# Altium schematic sheet Distance Switch IR and Hall.SchDoc
size A4
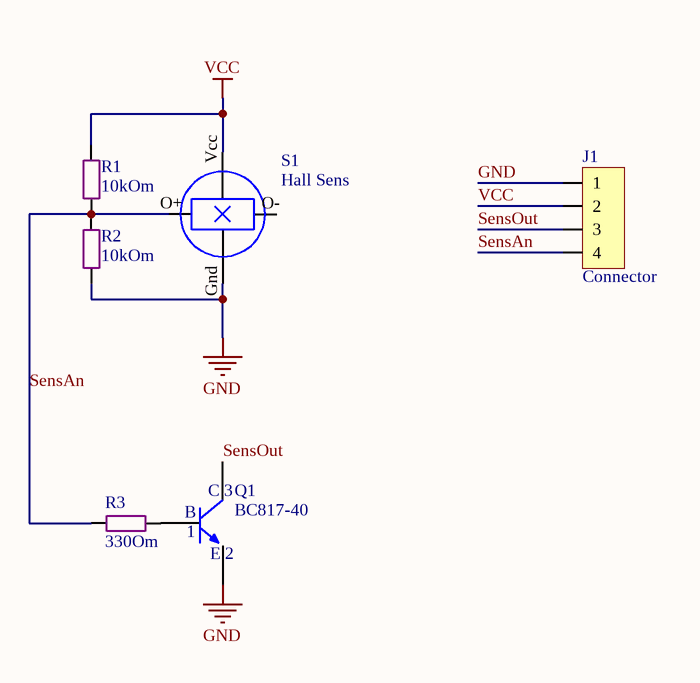
[diagram p0: Distance Switch IR and Hall.SchDoc]

## Parts
J1  Connector  [Molex Micro-Fit 3.0 - 4 pin D R]
Q1  BC817-40  [SOT-23]
R1  10kOm  [SMD 0805 (2012)]
R2  10kOm  [SMD 0805 (2012)]
R3  330Om  [SMD 0805 (2012)]
S1  Hall Sens  [Hall Sensor 3Pin]

## Nets
GND: J1.1 Q1.2(E) R2.1 S1.Gnd
VCC: J1.2 R1.2 S1.Vcc
SensAn: J1.4 R1.1 R2.2 R3.1 S1.O+
SensOut: J1.3 Q1.3(C)
NetQ1_1: Q1.1(B) R3.2

Not connected (* = marked no-connect by the designer): S1 O-

## Notes on the sheet
- (in symbol BC817-40) C 3; E 2

## Library data of the parts
J1 = Micro-Fit 4R (2x2): Horisontal, Dbl line, Male - 3mm; Part Number: 0430450402; Name: Micro-Fit 3.0; URL: http://www.molex.com/molex/products/datasheet.jsp?part=active/0430450402_PCB_HEADERS.xml
Q1 = BC817-40: NPN 45 V, 500 mA NPN general-purpose transistor; type: 45 V, 500 mA NPN general-purpose transistors; Name: BC817-40; url: http://lib.chipdip.ru/156/DOC000156781.pdf
R1-R3 = Res All Types
S1 = Hall Sensor K1116KP8: Name: К1116КП8